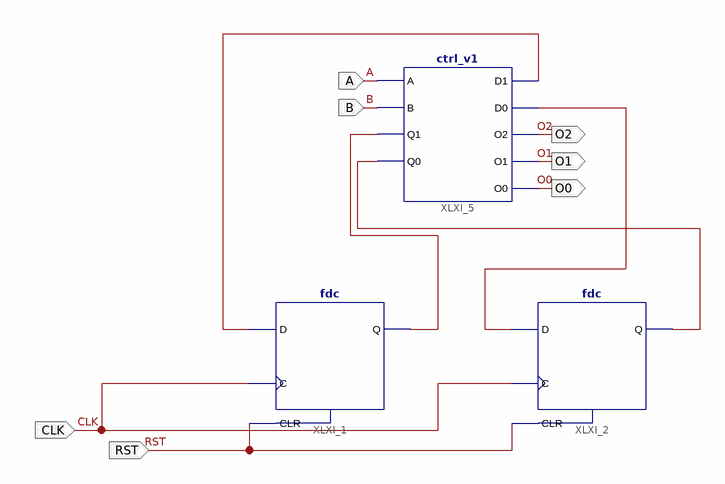
[diagram p0: schematic sheet 1]
// Xilinx ISE schematic ExamenP4_v1.sch (spartan3) as structural Verilog: 3 symbols, 7 ports
module ExamenP4_v1 (
  input  RST,
  input  CLK,
  input  A,
  input  B,
  output O2,
  output O1,
  output O0
);

  wire XLXN_9, XLXN_10, XLXN_11, XLXN_12;

  fdc XLXI_1 (.C(CLK), .CLR(RST), .D(XLXN_11), .Q(XLXN_9));
  fdc XLXI_2 (.C(CLK), .CLR(RST), .D(XLXN_12), .Q(XLXN_10));
  ctrl_v1 XLXI_5 (.A(A), .B(B), .D0(XLXN_12), .D1(XLXN_11), .O0(O0), .O1(O1), .O2(O2), .Q0(XLXN_10), .Q1(XLXN_9));
endmodule
